# EAGLE schematic NHK2016mother_rev4 (EAGLE 6.2)
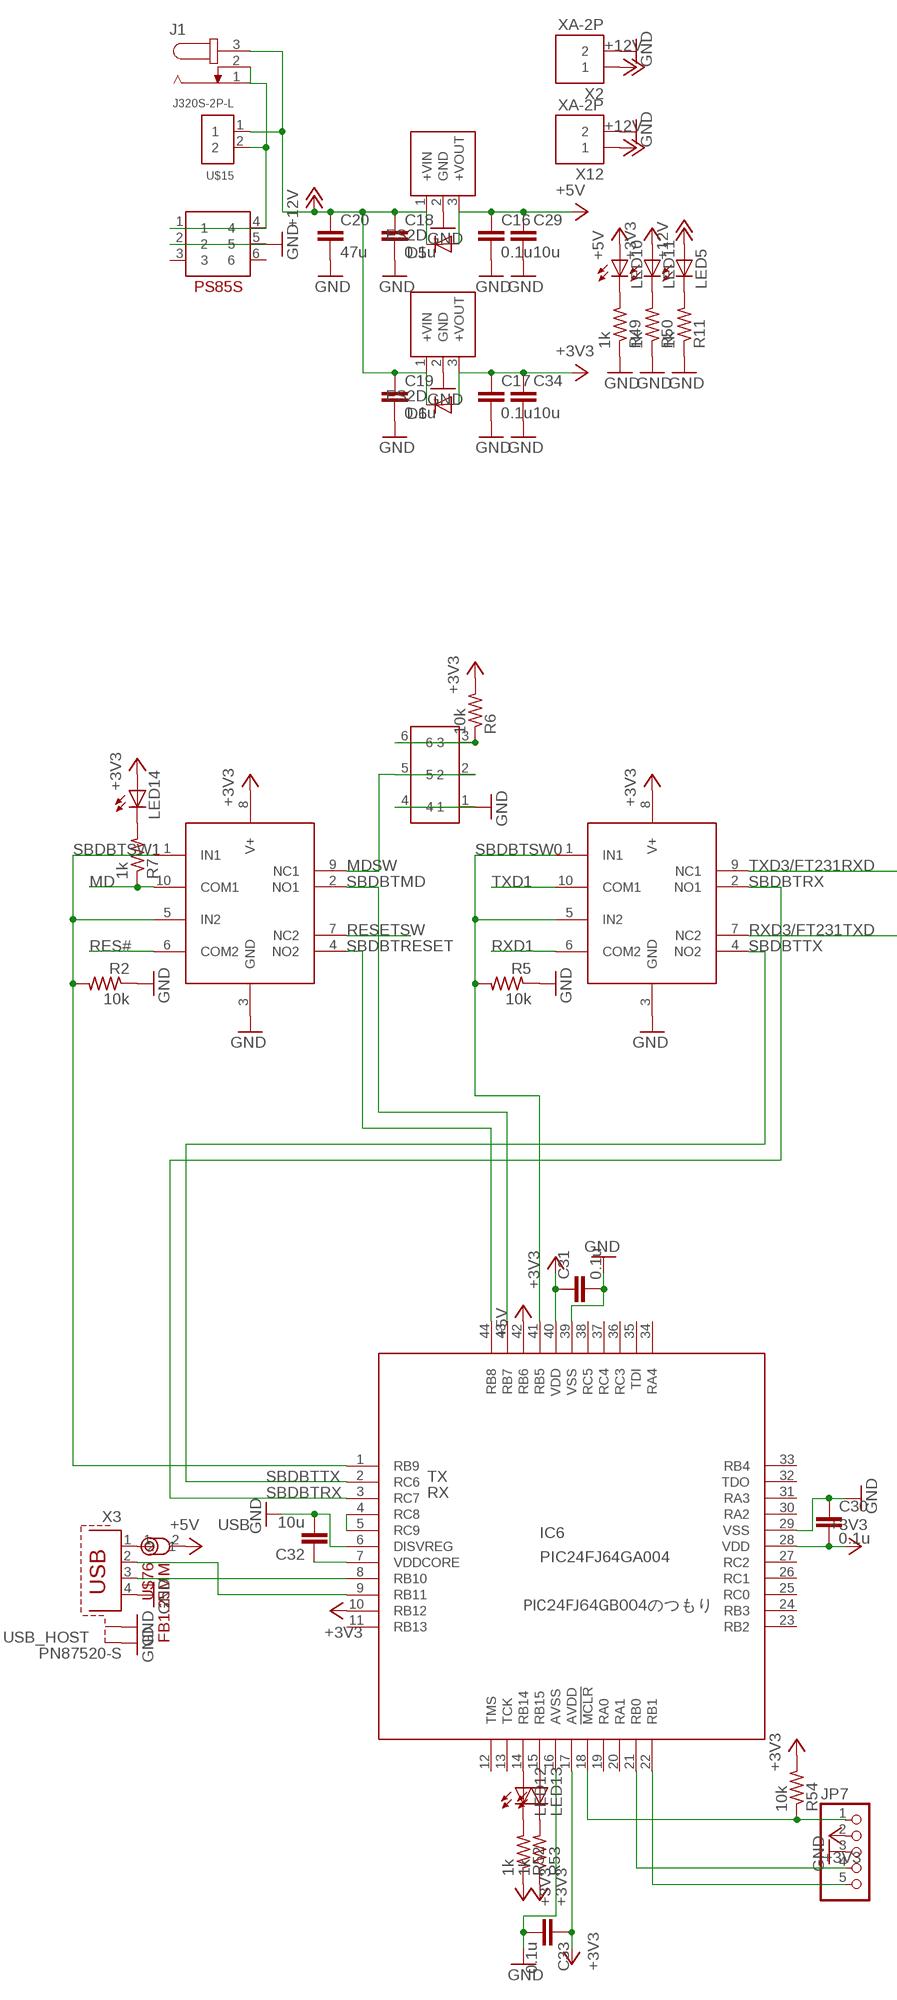
[diagram p0: schematic, sheet 1, part 1 of 2]
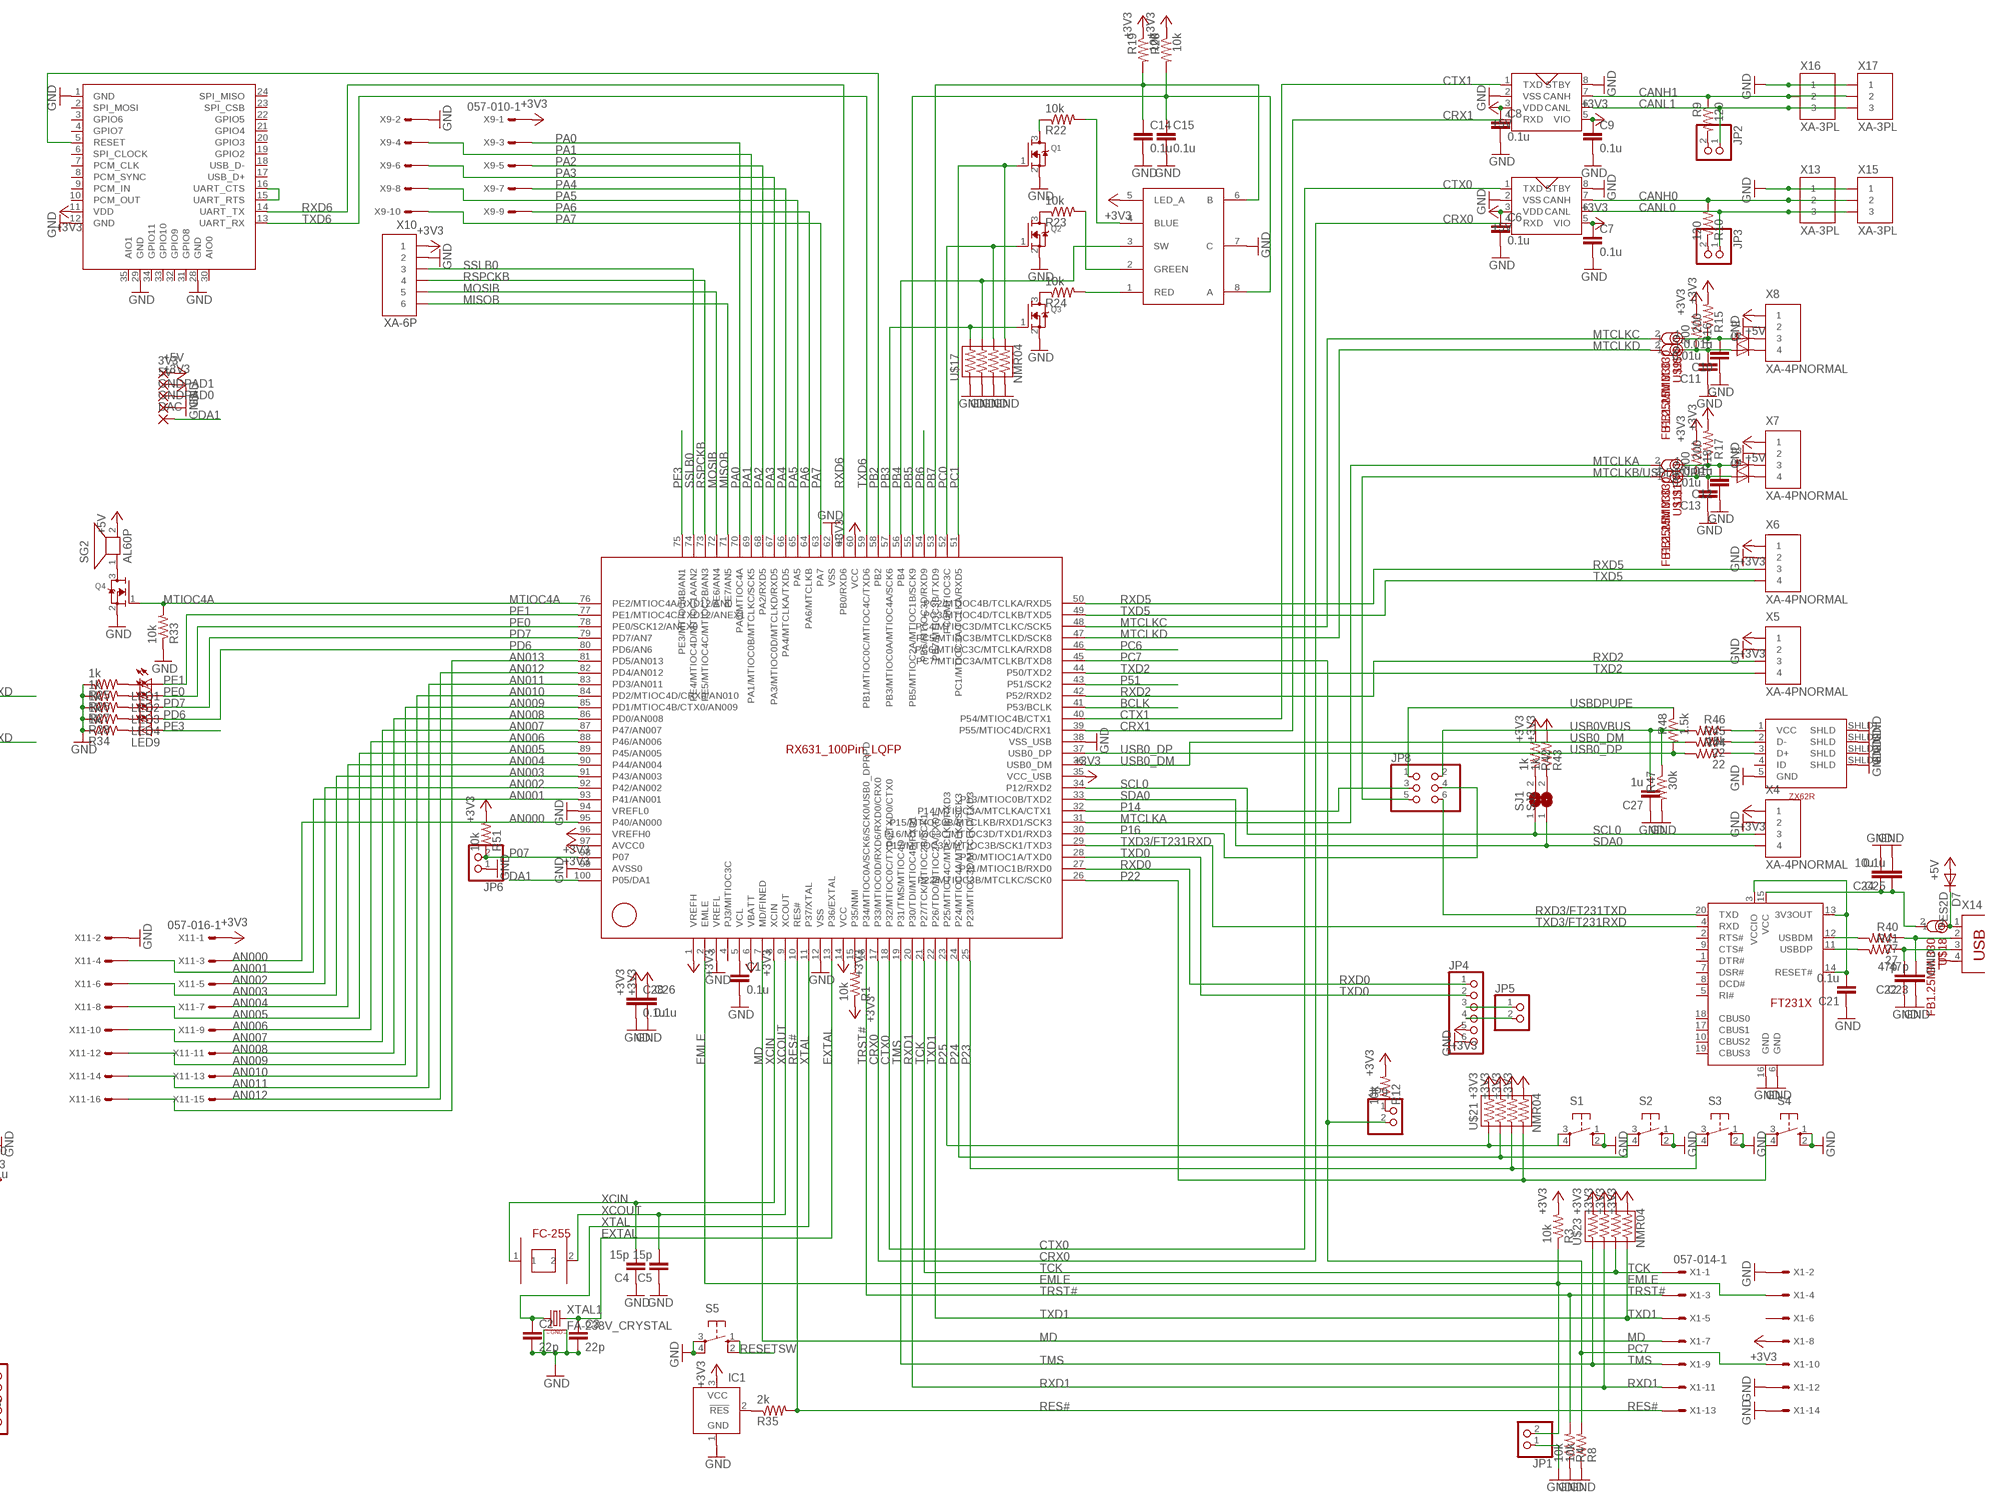
[diagram p1: schematic, sheet 1, part 2 of 2]

## Parts
3V3  1,6/0,8  [1,6/0,8]
5V  1,6/0,8  [1,6/0,8]
C1  0.1u  C-EUC0603K  [C0603K]
C2  22p  C-EUC2012  [C2012]
C3  22p  C-EUC2012  [C2012]
C4  15p  C-EUC0603K  [C0603K]
C5  15p  C-EUC0603K  [C0603K]
C6  0.1u  C-EUC0603K  [C0603K]
C7  0.1u  C-EUC0603K  [C0603K]
C8  0.1u  C-EUC0603K  [C0603K]
C9  0.1u  C-EUC0603K  [C0603K]
C10  0.01u  C-EUC0603K  [C0603K]
C11  0.01u  C-EUC0603K  [C0603K]
C12  0.01u  C-EUC0603K  [C0603K]
C13  0.01u  C-EUC0603K  [C0603K]
C14  0.1u  C-EUC0603K  [C0603K]
C15  0.1u  C-EUC0603K  [C0603K]
C16  0.1u  C-EUC0603K  [C0603K]
C17  0.1u  C-EUC0603K  [C0603K]
C18  0.1u  C-EUC0603K  [C0603K]
C19  0.1u  C-EUC0603K  [C0603K]
C20  47u  C-EUC3225  [C3225]
C21  0.1u  C-EUC0603K  [C0603K]
C22  47p  C-EUC0603K  [C0603K]
C23  47p  C-EUC0603K  [C0603K]
C24  10u  C-EUC1608  [C1608]
C25  0.1u  C-EUC0603K  [C0603K]
C26  0.1u  C-EUC0603K  [C0603K]
C27  1u  C-EUC0603K  [C0603K]
C28  0.1u  C-EUC0603K  [C0603K]
C29  10u  C-EUC1608  [C1608]
C30  0.1u  C-EUC0603K  [C0603K]
C31  0.1u  C-EUC0603K  [C0603K]
C32  10u  C-EUC1608  [C1608]
C33  0.1u  C-EUC0603K  [C0603K]
C34  10u  C-EUC1608  [C1608]
D1  DIODESOD-523  [SOD-523]
D2  DIODESOD-523  [SOD-523]
D3  DIODESOD-523  [SOD-523]
D4  DIODESOD-523  [SOD-523]
D5  ES2D  [SMB]
D6  ES2D  [SMB]
D7  ES2D  [SMB]
DAC  1,6/0,8  [1,6/0,8]
FT231XS  FT231X  [SSOP20]
GNDPAD0  1,6/0,8  [1,6/0,8]
GNDPAD1  1,6/0,8  [1,6/0,8]
IC1  TCM809  [SOT23B-3]
IC6  PIC24FJ64GA004  [TQFP44]
J1  JACK-PLUG1  [SPC4078]
JP1  PINHD-1X2  [1X02]
JP2  PINHD-1X2  [1X02]
JP3  PINHD-1X2  [1X02]
JP4  PINHD-1X6  [1X06]
JP5  PINHD-1X2  [1X02]
JP6  PINHD-1X2  [1X02]
JP7  PINHD-1X5  [1X05]
JP8  PINHD-2X3  [2X03]
JP9  PINHD-1X2  [1X02]
LED1  LEDSML0805  [SML0805]
LED2  LEDSML0805  [SML0805]
LED3  LEDSML0805  [SML0805]
LED4  LEDSML0805  [SML0805]
LED5  LEDSML0805  [SML0805]
LED9  LEDSML0805  [SML0805]
LED10  LEDSML0805  [SML0805]
LED11  LEDSML0805  [SML0805]
LED12  LEDSML0805  [SML0805]
LED13  LEDSML0805  [SML0805]
LED14  LEDSML0805  [SML0805]
Q1  MOSFET-NREFLOW  [SOT23]
Q2  MOSFET-NREFLOW  [SOT23]
Q3  MOSFET-NREFLOW  [SOT23]
Q4  MOSFET-NREFLOW  [SOT23]
R1  10k  R-US_MELF0102W  [MINI_MELF-0102W]
R2  10k  R-US_MELF0102W  [MINI_MELF-0102W]
R3  10k  R-US_MELF0102W  [MINI_MELF-0102W]
R4  10k  R-US_MELF0102W  [MINI_MELF-0102W]
R5  10k  R-US_MELF0102W  [MINI_MELF-0102W]
R6  10k  R-US_MELF0102W  [MINI_MELF-0102W]
R7  1k  R-US_MELF0102W  [MINI_MELF-0102W]
R8  10k  R-US_MELF0102W  [MINI_MELF-0102W]
R9  120  R-US_MELF0102W  [MINI_MELF-0102W]
R10  120  R-US_MELF0102W  [MINI_MELF-0102W]
R11  1k  R-US_MELF0102W  [MINI_MELF-0102W]
R12  10k  R-US_MELF0102W  [MINI_MELF-0102W]
R15  200  R-US_MELF0102W  [MINI_MELF-0102W]
R16  200  R-US_MELF0102W  [MINI_MELF-0102W]
R17  200  R-US_MELF0102W  [MINI_MELF-0102W]
R18  200  R-US_MELF0102W  [MINI_MELF-0102W]
R19  10k  R-US_MELF0102W  [MINI_MELF-0102W]
R20  10k  R-US_MELF0102W  [MINI_MELF-0102W]
R22  10k  R-US_MELF0102W  [MINI_MELF-0102W]
R23  10k  R-US_MELF0102W  [MINI_MELF-0102W]
R24  10k  R-US_MELF0102W  [MINI_MELF-0102W]
R25  1k  R-US_MELF0102W  [MINI_MELF-0102W]
R26  1k  R-US_MELF0102W  [MINI_MELF-0102W]
R27  1k  R-US_MELF0102W  [MINI_MELF-0102W]
R28  1k  R-US_MELF0102W  [MINI_MELF-0102W]
R33  10k  R-US_MELF0102W  [MINI_MELF-0102W]
R34  1k  R-US_MELF0102W  [MINI_MELF-0102W]
R35  2k  R-US_MELF0102W  [MINI_MELF-0102W]
R40  27  R-US_MELF0102W  [MINI_MELF-0102W]
R41  27  R-US_MELF0102W  [MINI_MELF-0102W]
R42  1k  R-US_MELF0102W  [MINI_MELF-0102W]
R43  1k  R-US_MELF0102W  [MINI_MELF-0102W]
R44  22  R-US_MELF0102W  [MINI_MELF-0102W]
R45  22  R-US_MELF0102W  [MINI_MELF-0102W]
R46  15k  R-US_MELF0102W  [MINI_MELF-0102W]
R47  30k  R-US_MELF0102W  [MINI_MELF-0102W]
R48  1.5k  R-US_MELF0102W  [MINI_MELF-0102W]
R49  1k  R-US_MELF0102W  [MINI_MELF-0102W]
R50  1k  R-US_MELF0102W  [MINI_MELF-0102W]
R51  10k  R-US_MELF0102W  [MINI_MELF-0102W]
R52  1k  R-US_MELF0102W  [MINI_MELF-0102W]
R53  1k  R-US_MELF0102W  [MINI_MELF-0102W]
R54  10k  R-US_MELF0102W  [MINI_MELF-0102W]
S1  10-XX  [B3F-10XX]
S2  10-XX  [B3F-10XX]
S3  10-XX  [B3F-10XX]
S4  10-XX  [B3F-10XX]
S5  10-XX  [B3F-10XX]
SG2  AL60P  [AL60P]
SJ1  SJ  [SJ]
SJ2  SJ  [SJ]
U$1  R5F5631FDDFP  [LQFP100]
U$3  FC-255  [FC-255]
U$4  MCP2562  [MCP2562]
U$5  MCP2562  [MCP2562]
U$8  FB1.25MM 330  FB1.25MM  [2012]
U$9  FB1.25MM 330  FB1.25MM  [2012]
U$10  FB1.25MM 330  FB1.25MM  [2012]
U$11  FB1.25MM 330  FB1.25MM  [2012]
U$12  RN42  [RN42]
U$13  M78AR033-0.5  [M78AR033-0.5V]
U$14  M78AR033-0.5  [M78AR033-0.5V]
U$15  J320S-2P-L  [J320S-2P-L]
U$16  PS-85S  [PS-85S]
U$17  NMR04  [MNR04]
U$18  FB1.25MM 330  FB1.25MM  [2012]
U$21  NMR04  [MNR04]
U$22  ZX62R  [ZX62R]
U$23  NMR04  [MNR04]
U$24  MULTIPLEXER2CIR  [MULTIPLEXER2CIR]
U$25  MULTIPLEXER2CIR  [MULTIPLEXER2CIR]
U$58  EC12PLRGBSDVBF  [EC12PLRGBSDVBF]
U$76  FB1.25MM  [2012]
U$82  SSSS2  [SSSS2]
X1  057-014-1  [057-014-1]
X2  XA-2P  [XA-2P]
X3  PN87520-S  [PN87520-S]
X4  XA-4PNORMAL  [XA-4P]
X5  XA-4PNORMAL  [XA-4P]
X6  XA-4PNORMAL  [XA-4P]
X7  XA-4PNORMAL  [XA-4P]
X8  XA-4PNORMAL  [XA-4P]
X9  057-010-1  [057-010-1]
X10  XA-6P  [XA-6P]
X11  057-016-1  [057-016-1]
X12  XA-2P  [XA-2P]
X13  XA-3PL  [XA-3P-L]
X14  PN61729  [PN61729]
X15  XA-3PL  [XA-3P-L]
X16  XA-3PL  [XA-3P-L]
X17  XA-3PL  [XA-3P-L]
XTAL1  FA-238V_CRYSTAL  [FA-238V_CRYSTAL]

## Nets
12V-: J1.1 J1.2 U$15.2 U$16.1 U$16.4
+3V3: 5V.1(P) C7.1 C9.1 C17.1 C26.1 C28.1 C30.2 C31.1 C33.1 C34.1 D6.A IC1.3(VCC) IC6.10(RB12) IC6.17(AVDD) IC6.28(VDD) IC6.40(VDD) JP4.5 JP7.2 LED11.A LED14.A R1.1 R3.2 R6.2 R12.2 R15.2 R16.2 R17.2 R18.2 R19.1 R20.1 R42.2 R43.2 R51.2 R52.1 R53.1 R54.2 U$1.1(VREFH) U$1.6(VBATT) U$1.14(VCC) U$1.35(VCC_USB) U$1.60(VCC) U$1.96(VREFH0) U$1.97(AVCC0) U$4.5(VIO) U$5.5(VIO) U$12.11(VDD) U$14.3(+VOUT) U$21.2 U$21.4 U$21.6 U$21.8 U$23.2 U$23.4 U$23.6 U$23.8 U$24.8(V+) U$25.8(V+) U$58.5(LED_A) X1.8 X4.1 X5.1 X6.1 X9.1 X10.1 X11.1
+5V: 3V3.1(P) C6.1 C8.1 C16.1 C29.1 D5.A D7.A IC6.42(RB6) LED10.A SG2.2 U$4.3(VDD) U$5.3(VDD) U$13.3(+VOUT) U$76.2 X7.1 X8.1
+12V: C18.1 C19.1 C20.1 D5.C D6.C J1.3 LED5.A U$13.1(+VIN) U$14.1(+VIN) U$15.1 X2.1 X12.1
AN000: U$1.95(P40/AN000) X11.3
AN001: U$1.93(P41/AN001) X11.4
AN002: U$1.92(P42/AN002) X11.5
AN003: U$1.91(P43/AN003) X11.6
AN004: U$1.90(P44/AN004) X11.7
AN005: U$1.89(P45/AN005) X11.8
AN006: U$1.88(P46/AN006) X11.9
AN007: U$1.87(P47/AN007) X11.10
AN008: U$1.86(PD0/AN008) X11.11
AN009: U$1.85(PD1/MTIOC4B/CTX0/AN009) X11.12
AN010: U$1.84(PD2/MTIOC4D/CRX0/AN010) X11.13
AN011: U$1.83(PD3/AN011) X11.14
AN012: U$1.82(PD4/AN012) X11.15
AN013: U$1.81(PD5/AN013) X11.16
BCLK: U$1.41(P53/BCLK)
CANH0: R10.2 U$5.7(CANH) X13.2 X15.2
CANH1: R9.1 U$4.7(CANH) X16.2 X17.2
CANL0: JP3.1 U$5.6(CANL) X13.3 X15.3
CANL1: JP2.1 U$4.6(CANL) X16.3 X17.3
CRX0: U$1.17(P33/MTIOC0D/RXD6/RXD0/CRX0) U$5.4(RXD)
CRX1: U$1.39(P55/MTIOC4D/CRX1) U$4.4(RXD)
CTX0: U$1.18(P32/MTIOC0C/TXD6/TXD0/CTX0) U$5.1(TXD)
CTX1: U$1.40(P54/MTIOC4B/CTX1) U$4.1(TXD)
DA1: DAC.1(P) U$1.100(P05/DA1)
EMLE: JP1.2 R3.1 U$1.2(EMLE) X1.4
EXTAL: C3.1 U$1.13(P36/EXTAL) XTAL1.3
GND: C1.2 C2.2 C3.2 C4.1 C5.1 C6.2 C7.2 C8.2 C9.2 C10.1 C11.1 C12.1 C13.1 C14.2 C15.2 C16.2 C17.2 C18.2 C19.2 C20.2 C21.1 C22.1 C23.1 C24.2 C25.2 C26.2 C27.1 C28.2 C29.2 C30.1 C31.2 C32.2 C33.2 C34.2 FT231XS.6(GND) FT231XS.16(GND) GNDPAD0.1(P) GNDPAD1.1(P) IC1.1(GND) IC6.6(DISVREG) IC6.16(AVSS) IC6.29(VSS) IC6.39(VSS) JP1.1 JP4.6 JP6.1 JP7.3 Q1.2(S) Q2.2(S) Q3.2(S) Q4.2(S) R2.1 R4.1 R5.1 R8.1 R11.1 R25.1 R26.1 R27.1 R28.1 R33.1 R34.1 R47.2 R49.1 R50.1 S1.1(S) S1.2(S1) S2.1(S) S2.2(S1) S3.1(S) S3.2(S1) S4.1(S) S4.2(S1) S5.3(P) S5.4(P1) U$1.3(VREFL) U$1.12(VSS) U$1.38(VSS_USB) U$1.62(VSS) U$1.94(VREFL0) U$1.99(AVSS0) U$4.2(VSS) U$4.8(STBY) U$5.2(VSS) U$5.8(STBY) U$12.1(GND) U$12.12(GND) U$12.28(GND) U$12.29(GND) U$13.2(GND) U$14.2(GND) U$16.2 U$16.5 U$17.1 U$17.3 U$17.5 U$17.7 U$22.5(GND) U$22.SHLD1(SHLD) U$22.SHLD2(SHLD) U$22.SHLD3(SHLD) U$22.SHLD4(SHLD) U$24.3(GND) U$25.3(GND) U$58.7(C) U$82.1 U$82.4 X1.2 X1.12 X1.14 X2.2 X3.4 X3.S1 X3.S2 X4.2 X5.2 X6.2 X7.2 X8.2 X9.2 X10.2 X11.2 X12.2 X13.1 X14.4 X15.1 X16.1 X17.1 XTAL1.2(GND1) XTAL1.4(GND2)
MD: R7.1 U$1.7(MD/FINED) U$24.10(COM1) X1.7
MDSW: U$24.9(NC1) U$82.2 U$82.5
MISOB: U$1.71(PE7/AN5) X10.6
MOSIB: U$1.72(PE6/AN4) X10.5
MTCLKA: U$1.31(P15/MTIOC0B/MTCLKB/RXD1/SCK3) U$10.2
MTCLKB/USBDPUPE: JP8.5 U$11.2
MTCLKC: U$1.48(PC4/MTIOC3D/MTCLKC/SCK5) U$8.2
MTCLKD: U$1.47(PC5/MTIOC3B/MTCLKD/SCK8) U$9.2
MTIOC4A: Q4.1(G) R33.2 U$1.76(PE2/MTIOC4A/RXD12/AN0)
N$1: JP4.3 JP5.1
N$2: JP4.4 JP5.2
N$3: JP2.2 R9.2
N$4: JP3.2 R10.1
N$5: D1.K(C) X8.3
N$6: D2.K(C) X8.4
N$7: D3.K(C) X7.3
N$8: D4.K(C) X7.4
N$9: C10.2 D1.A R15.1 U$8.1
N$10: C11.2 D2.A R16.1 U$9.1
N$11: C12.2 D3.A R17.1 U$10.1
N$12: C13.2 D4.A R18.1 U$11.1
N$13: R22.2 U$58.4(BLUE)
N$14: R23.2 U$58.2(GREEN)
N$15: R24.2 U$58.1(RED)
N$16: Q1.3(D) R22.1
N$17: Q2.3(D) R23.1
N$18: Q3.3(D) R24.1
N$19: LED9.C R34.2
N$20: IC6.22(RB1) JP7.5
N$21: U$12.15(UART_RTS) U$12.16(UART_CTS)
N$22: Q4.3(D) SG2.1
N$23: LED1.C R25.2
N$24: LED2.C R26.2
N$25: LED3.C R27.2
N$26: LED4.C R28.2
N$27: LED5.C R11.2
N$28: JP9.1 R12.1
N$31: C1.1 U$1.5(VCL)
N$32: R1.2 U$1.15(P35/NMI)
N$33: IC1.2(!RES) R35.1
N$34: FT231XS.12(USBDM) R40.2
N$35: FT231XS.11(USBDP) R41.2
N$36: C21.2 FT231XS.3(VCCIO) FT231XS.13(3V3OUT) FT231XS.14(RESET#)
N$37: C22.2 R41.1 X14.3
N$38: C23.2 R40.1 X14.2
N$39: D7.C U$18.1 X14.1
N$40: C24.1 C25.1 FT231XS.15(VCC) U$18.2
N$41: R42.1 SJ1.2
N$42: R43.1 SJ2.2
N$43: LED10.C R49.2
N$44: R45.1 U$22.2(D-)
N$45: R44.1 U$22.3(D+)
N$46: R46.1 U$22.1(VCC)
N$47: LED11.C R50.2
N$49: IC6.14(RB14) LED12.A
N$50: C32.1 IC6.7(VDDCORE)
N$51: IC6.4(RC8) IC6.5(RC9)
N$52: IC6.8(RB10) X3.3
N$53: IC6.9(RB11) X3.2
N$54: U$76.1 X3.1
N$55: IC6.15(RB15) LED13.A
N$56: LED12.C R52.2
N$57: LED13.C R53.2
N$58: IC6.18(!MCLR) JP7.1 R54.1
N$59: IC6.21(RB0) JP7.4
N$60: LED14.C R7.2
N$65: R6.1 U$82.3 U$82.6
P07: JP6.2 R51.1 U$1.98(P07)
P14: JP8.3 U$1.32(P14/MTIOC3A/MTCLKA/CTX1)
P16: JP8.4 U$1.30(P16/MTIOC3C/MTIOC3D/TXD1/RXD3)
P22: S4.3(P) S4.4(P1) U$1.26(P22/MTIOC3B/MTCLKC/SCK0) U$21.7
P23: S3.3(P) S3.4(P1) U$1.25(P23/MTIOC3D/MTCLKD/TXD3) U$21.5
P24: S2.3(P) S2.4(P1) U$1.24(P24/MTIOC4A/MTCLKA/SCK3) U$21.3
P25: S1.3(P) S1.4(P1) U$1.23(P25/MTIOC4C/MTCLKB/RXD3) U$21.1
P51: U$1.43(P51/SCK2)
PA0: U$1.70(PA0/MTIOC4A) X9.3
PA1: U$1.69(PA1/MTIOC0B/MTCLKC/SCK5) X9.4
PA2: U$1.68(PA2/RXD5) X9.5
PA3: U$1.67(PA3/MTIOC0D/MTCLKD/RXD5) X9.6
PA4: U$1.66(PA4/MTCLKA/TXD5) X9.7
PA5: U$1.65(PA5) X9.8
PA6: U$1.64(PA6/MTCLKB) X9.9
PA7: U$1.63(PA7) X9.10
PB2: U$1.58(PB2) U$12.5(RESET)
PB3: Q3.1(G) U$1.57(PB3/MTIOC0A/MTIOC4A/SCK6) U$17.2
PB4: U$1.56(PB4) U$17.4 U$58.3(SW)
PB5: C15.1 R20.2 U$1.55(PB5/MTIOC2A/MTIOC1B/SCK9) U$58.8(A)
PB6: U$1.54(PB6/MTIOC3D/RXD9)
PB7: C14.1 R19.2 U$1.53(PB7/MTIOC3B/TXD9) U$58.6(B)
PC0: Q2.1(G) U$1.52(PC0/MTIOC3C) U$17.6
PC1: Q1.1(G) U$1.51(PC1/MTIOC3A/TCLKA/RXD5) U$17.8
PC6: U$1.46(PC6/MTIOC3C/MTCLKA/RXD8)
PC7: JP9.2 R8.2 U$1.45(PC7/MTIOC3A/MTCLKB/TXD8) X1.10
PD6: LED4.A U$1.80(PD6/AN6)
PD7: LED3.A U$1.79(PD7/AN7)
PE0: LED2.A U$1.78(PE0/SCK12/ANEX0)
PE1: LED1.A U$1.77(PE1/MTIOC4C/TXD12/ANEX1)
PE3: LED9.A U$1.75(PE3/MTIOC4B/AN1)
RES#: R35.2 U$1.10(RES#) U$24.6(COM2) X1.13
RESETSW: S5.1(S) S5.2(S1) U$24.7(NC2)
RSPCKB: U$1.73(PE5/MTIOC4C/MTIOC2B/AN3) X10.4
RXD0: JP4.1 U$1.27(P21/MTIOC1B/RXD0)
RXD1: U$1.20(P30/TDI/MTIOC4B/RXD1) U$23.3 U$25.6(COM2) X1.11
RXD2: U$1.42(P52/RXD2) X5.3
RXD3/FT231TXD: FT231XS.20(TXD) JP8.6 U$25.7(NC2)
RXD5: U$1.50(PC2/MTIOC4B/TCLKA/RXD5) X6.3
RXD6: U$1.61(PB0/RXD6) U$12.14(UART_TX)
SBDBTMD: IC6.43(RB7) U$24.2(NO1)
SBDBTRESET: IC6.44(RB8) U$24.4(NO2)
SBDBTRX: IC6.3(RC7) U$25.2(NO1)
SBDBTSW0: IC6.41(RB5) R5.2 U$25.1(IN1) U$25.5(IN2)
SBDBTSW1: IC6.1(RB9) R2.2 U$24.1(IN1) U$24.5(IN2)
SBDBTTX: IC6.2(RC6) U$25.4(NO2)
SCL0: SJ1.1 U$1.34(P12/RXD2) X4.3
SDA0: SJ2.1 U$1.33(P13/MTIOC0B/TXD2) X4.4
SSLB0: U$1.74(PE4/MTIOC4D/MTIOC1A/AN2) X10.3
TCK: U$1.21(P27/TCK/MTIOC2B/SCK1) U$23.5 X1.1
TMS: U$1.19(P31/TMS/MTIOC4D) U$23.1 X1.9
TRST#: R4.2 U$1.16(P34/MTIOC0A/SCK6/SCK0/USB0_DPRPD) X1.3
TXD0: JP4.2 U$1.28(P20/MTIOC1A/TXD0)
TXD1: U$1.22(P26/TDO/MTIOC2A/TXD1) U$23.7 U$25.10(COM1) X1.5
TXD2: U$1.44(P50/TXD2) X5.4
TXD3/FT231RXD: FT231XS.4(RXD) U$1.29(P17/MTIOC3A/MTIOC3B/SCK1/TXD3) U$25.9(NC1)
TXD5: U$1.49(PC3/MTIOC4D/TCLKB/TXD5) X6.4
TXD6: U$1.59(PB1/MTIOC0C/MTIOC4C/TXD6) U$12.13(UART_RX)
USB0_DM: R45.2 U$1.36(USB0_DM)
USB0_DP: R44.2 R48.2 U$1.37(USB0_DP)
USB0VBUS: C27.2 JP8.2 R46.2 R47.1
USBDPUPE: JP8.1 R48.1
XCIN: C4.2 U$1.8(XCIN) U$3.1
XCOUT: C5.2 U$1.9(XCOUT) U$3.2
XTAL: C2.1 U$1.11(P37/XTAL) XTAL1.1
Unconnected: FT231XS.1(DTR#) FT231XS.2(RTS#) FT231XS.5(RI#) FT231XS.7(DSR#) FT231XS.8(DCD#) FT231XS.9(CTS#) FT231XS.10(CBUS2) FT231XS.17(CBUS1) FT231XS.18(CBUS0) FT231XS.19(CBUS3) IC6.11(RB13) IC6.12(TMS) IC6.13(TCK) IC6.19(RA0) IC6.20(RA1) IC6.23(RB2) IC6.24(RB3) IC6.25(RC0) IC6.26(RC1) IC6.27(RC2) IC6.30(RA2) IC6.31(RA3) IC6.32(TDO) IC6.33(RB4) IC6.34(RA4) IC6.35(TDI) IC6.36(RC3) IC6.37(RC4) IC6.38(RC5) U$1.4(PJ3/MITIOC3C) U$12.2(SPI_MOSI) U$12.3(GPIO6) U$12.4(GPIO7) U$12.6(SPI_CLOCK) U$12.7(PCM_CLK) U$12.8(PCM_SYNC) U$12.9(PCM_IN) U$12.10(PCM_OUT) U$12.17(USB_D+) U$12.18(USB_D-) U$12.19(GPIO2) U$12.20(GPIO3) U$12.21(GPIO4) U$12.22(GPIO5) U$12.23(SPI_CSB) U$12.24(SPI_MISO) U$12.30(AIO0) U$12.31(GPIO8) U$12.32(GPIO9) U$12.33(GPIO10) U$12.34(GPIO11) U$12.35(AIO1) U$16.3 U$16.6 U$22.4(ID) X1.6

## Notes on the sheet
- TX
- RX
- USB
- PIC24FJ64GB004のつもり
- USB_HOST

## Library data of the parts
3V3 5V DAC GNDPAD0 GNDPAD1 = wirepad:1,6/0,8: THROUGH-HOLE PAD
C1-C34 = rcl:C-EU: CAPACITOR, European symbol
D1-D4 = adafruit:DIODE: Diode SMADIODE - SMA Surface Mount Package 20V 1A Schottky Diode Digikey: 641-1014-6-ND DO-1N4148 - Through Hole Small Current Diode SOD-123 20V 1 A (.5mV Vf) Schottky Diode - Digikey: MBRX120TPMSCT-ND SOD-323 10V 570mA (.38mV Vf, 3ns) Schottky Diode - Digikey: ZLLS410CT-ND SOD-523 30V 30mA Schottky Diode (RB751S-40TE61) - Digikey: RB751S-40TE61CT-ND SOT23-R/W - SOT23 Package (R = Solder Paste/Reflow Ovens, W = Hand-Soldering) BAT54Film 40V 300mA - Digikey: 497-7162-1-ND
D5-D7 = diode:ES2D: DIODE super fast rectifier, 2 A
FT231XS = kerawo:FT231X
IC1 = telcom:TCM809: POWER SUPPLY MONITOR replacement for Maxim MAX809 and MAX810; MF: MICROCHIP; MPN: TCM809MENB713; OC_FARNELL: 9762744; OC_NEWARK: 96K3998
IC6 = microchip:PIC24FJ64GA004: PIC24FJ64GA004 edit this description Auto generated by make-symbol-device-package-bsdl.ulp Rev. 25 Source: PIC24FJ64GA004.bsd; MPN: PIC24FJ64GA004-E/PT; OC_FARNELL: 1332299; OC_NEWARK: 98M1927
J1 = con-jack:JACK-PLUG: DC POWER JACK Power Jack, DC, Right Angle, Through Hole, Rated 5A at 16VDC, PC Terminals Distributor: Farnell (www.Farnell.de) Drawing: 84N1161.pdf / 84N1162.pdf Manufacturer: SPC Technology (www.spctechnology.com) Type: SPC4077 / SPC 4078; OC_FARNELL: unknown; OC_NEWARK: unknown
JP1-JP3 JP5 JP6 JP9 = pinhead:PINHD-1X2: PIN HEADER
JP4 = pinhead:PINHD-1X6: PIN HEADER
JP7 = pinhead:PINHD-1X5: PIN HEADER
JP8 = pinhead:PINHD-2X3: PIN HEADER
LED1-LED5 LED9-LED14 = led:LED: LED OSRAM: - CHIPLED LG R971, LG N971, LY N971, LG Q971, LY Q971, LO R971, LY R971 LH N974, LH R974 LS Q976, LO Q976, LY Q976 LO Q996 - Hyper CHIPLED LW Q18S LB Q993, LB Q99A, LB R99A - SideLED LS A670, LO A670, LY A670, LG A670, LP A670 LB A673, LV A673, LT A673, LW A673 LH A674 LY A675 LS A676, LA A676, LO A676, LY A676, LW A676 LS A679, LY A679, LG A679 - Hyper Micro SIDELED® LS Y876, LA Y876, LO Y876, LY Y876 LT Y87S - SmartLED LW L88C, LW L88S LB L89C, LB L89S, LG L890 LS L89K, LO L89K, LY L89K LS L896, LA L896, LO L896, LY L896 - TOPLED LS T670, LO T670, LY T670, LG T670, LP T670 LSG T670, LSP T670, LSY T670, LOP T670, LYG T670 LG T671, LOG T671, LSG T671 LB T673, LV T673, LT T673, LW T673 LH T674 LS T676, LA T676, LO T676, LY T676, LB T676, LH T676, LSB T676, LW T676 LB T67C, LV T67C, LT T67C, LS T67K, LO T67K, LY T67K, LW E67C LS E67B, LA E67B, LO E67B, LY E67B, LB E67C, LV E67C, LT E67C LW T67C LS T679, LY T679, LG T679 LS T770, LO T770, LY T770, LG T770, LP T770 LB T773, LV T773, LT T773, LW T773 LH T774 LS E675, LA E675, LY E675, LS T675 LS T776, LA T776, LO T776, LY T776, LB T776 LHGB T686 LT T68C, LB T68C - Hyper Mini TOPLED® LB M676 - Mini TOPLED Santana® LG M470 LS M47K, LO M47K, LY M47K Source: http://www.osram.convergy.de LUXEON: - LUMILED® LXK2-PW12-R00, LXK2-PW12-S00, LXK2-PW14-U00, LXK2-PW14-V00 LXK2-PM12-R00, LXK2-PM12-S00, LXK2-PM14-U00 LXK2-PE12-Q00, LXK2-PE12-R00, LXK2-PE12-S00, LXK2-PE14-T00, LXK2-PE14-U00 LXK2-PB12-K00, LXK2-PB12-L00, LXK2-PB12-M00, LXK2-PB14-N00, LXK2-PB14-P00, LXK2-PB14-Q00 LXK2-PR12-L00, LXK2-PR12-M00, LXK2-PR14-Q00, LXK2-PR14-R00 LXK2-PD12-Q00, LXK2-PD12-R00, LXK2-PD12-S00 LXK2-PH12-R00, LXK2-PH12-S00 LXK2-PL12-P00, LXK2-PL12-Q00, LXK2-PL12-R00 Source: www.luxeon.com KINGBRIGHT: KA-3528ASYC Source: www.kingbright.com
Q1-Q4 = adafruit:MOSFET-N: N-Channel Mosfet 2N7002E - 60V 260mA SOT23 [Digikey: 2N7002ET1GOSTR-ND] - REEL BSH103 - 30V 850mA SOT23 [Digikey: 568-5013-1-ND]
R1-R12 R15-R20 R22-R28 R33-R35 R40-R54 = rcl:R-US_: RESISTOR, American symbol
S1-S5 = switch-omron:10-XX: OMRON SWITCH; MPN: B3F-1000; OC_FARNELL: 176432; OC_NEWARK: 36M3542
SG2 = buzzer:AL60P: SPEAKER Source: Buerklin; OC_FARNELL: unknown; OC_NEWARK: unknown
SJ1 SJ2 = jumper:SJ: SMD solder JUMPER
U$1 = RX631:R5F5631FDDFP
U$3 = kerawo:FC-255
U$4 U$5 = kerawo:MCP2562
U$8-U$11 U$18 U$76 = CQ:FB1.25MM: MURATA Power Line Chip Ferrite Beads BLM21P <http://akizukidenshi.com/download/BLM21PG331SN.pdf> BLM21PG220SN1p 22Ω±25% 6000mA 0.01Ω -55℃～+125℃ BLM21PG300SN1p 30Ω(Typ.) 3000mA 0.015Ω -55℃～+125℃ BLM21PG600SN1p 60Ω±25% 3000mA 0.025Ω -55℃～+125℃ BLM21PG121SN1p 120Ω±25% 3000mA 0.03Ω -55℃～+125℃ BLM21PG221SN1p 220Ω±25% 2000mA 0.050Ω -55℃～+125℃ BLM21PG331SN1p 330Ω±25% 1500mA 0.09Ω -55℃～+125℃
U$12 = kerawo:RN42
U$13 U$14 = kerawo:M78AR033-0.5
U$15 = jfa:J320S-2P-L
U$16 = kerawo:PS-85S
U$17 U$21 U$23 = kerawo:NMR04
U$22 = kerawo:ZX62R
U$24 U$25 = Kushimiya:MULTIPLEXER2CIR
U$58 = 0Lib:EC12PLRGBSDVBF
U$82 = kerawo:SSSS2
X1 = con-panduit:057-014-: CONNECTOR 10-pin series 057 contact pc board low profile headers; OC_FARNELL: unknown; OC_NEWARK: unknown
X2 X12 = XA-Connectors:XA-2P
X3 = con-berg:PN87520-S; OC_FARNELL: unknown; OC_NEWARK: unknown
X4-X8 = XA-Connectors:XA-4P
X9 = con-panduit:057-010-: CONNECTOR 10-pin series 057 contact pc board low profile headers; OC_FARNELL: unknown; OC_NEWARK: unknown
X10 = XA-Connectors:XA-6P
X11 = con-panduit:057-016-: CONNECTOR 10-pin series 057 contact pc board low profile headers; OC_FARNELL: unknown; OC_NEWARK: unknown
X13 X15-X17 = XA-Connectors:XA-3P
X14 = con-berg:PN61729: BERG USB connector; OC_FARNELL: unknown; OC_NEWARK: unknown
XTAL1 = 20150531:FA-238V_CRYSTAL: 12MHzクリスタル 秋月品番: P-05225